# Altium project N64_Controller.PrjPcb
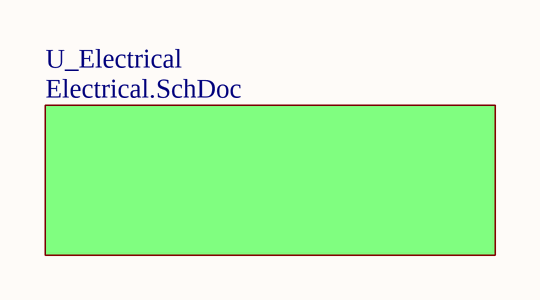
[diagram p0: TopSheet.SchDoc]
9 sheets, 114 parts. Net scope: strictly hierarchical (ports join the sheet entries above them; power ports are local).
Board file: PCB1.PcbDoc
Sheets:
  TopSheet.SchDoc
    U_Electrical = Electrical.SchDoc
      U_MCU = MCU.SchDoc
      U_USB = USB.SchDoc
      U_N64Connector = N64Connector.SchDoc
      U_LEDs = LEDs.SchDoc
      U_Rumble = Rumble.SchDoc
      U_Power = Power.SchDoc
      U_Buttons = Buttons.SchDoc

## Sheet TopSheet.SchDoc
size A

### Sub-sheets
U_Electrical = Electrical.SchDoc: no entries

## Sheet Electrical.SchDoc
size A4
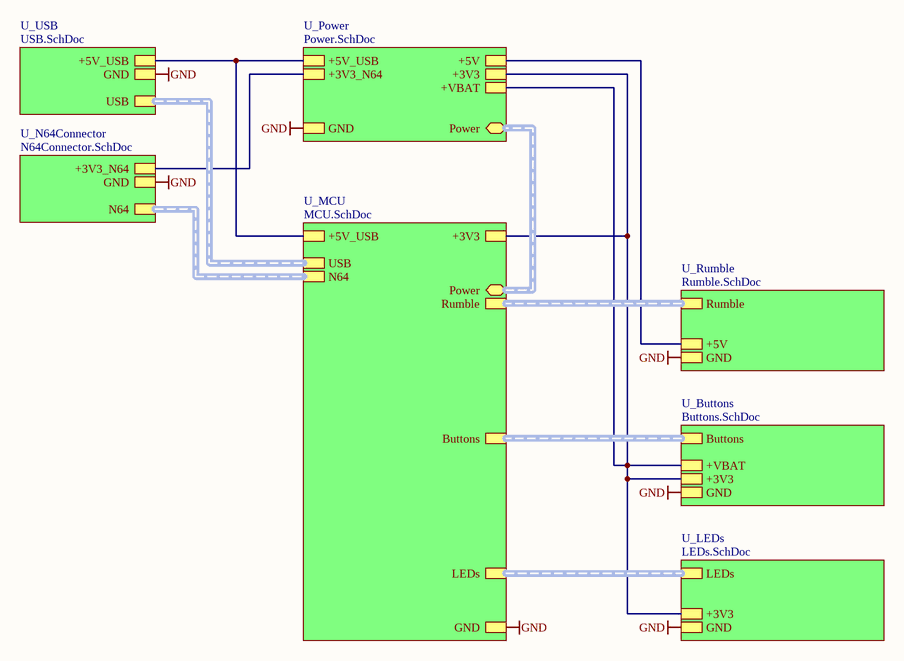
[diagram p1: Electrical.SchDoc]

### Sub-sheets
U_Buttons = Buttons.SchDoc: Buttons (harness Buttons), GND, +3V3, +VBAT
U_LEDs = LEDs.SchDoc: LEDs (harness LEDs), +3V3, GND
U_MCU = MCU.SchDoc: Buttons (harness Buttons), LEDs (harness LEDs), Rumble (harness Rumble), USB (harness USB), +3V3, +5V_USB, GND, N64 (harness N64), Power (harness Power)
U_N64Connector = N64Connector.SchDoc: N64 (harness N64), +3V3_N64, GND
U_Power = Power.SchDoc: +5V_USB, +3V3_N64, GND, +5V, +3V3, +VBAT, Power (harness Power)
U_Rumble = Rumble.SchDoc: GND, +5V, Rumble (harness Rumble)
U_USB = USB.SchDoc: +5V_USB, USB (harness USB), GND

### Nets
+3V3: sheet U_MCU/+3V3, sheet U_LEDs/+3V3, sheet U_Power/+3V3, sheet U_Power/+VBAT, sheet U_Buttons/+3V3, sheet U_Buttons/+VBAT
+3V3_N64: sheet U_N64Connector/+3V3_N64, sheet U_Power/+3V3_N64
+5V: sheet U_Rumble/+5V, sheet U_Power/+5V
+5V_USB: sheet U_MCU/+5V_USB, sheet U_USB/+5V_USB, sheet U_Power/+5V_USB
GND: sheet U_MCU/GND, sheet U_USB/GND, sheet U_N64Connector/GND, sheet U_LEDs/GND, sheet U_Rumble/GND, sheet U_Power/GND, sheet U_Buttons/GND

### Buses and harness runs
harness sheet U_Buttons/Buttons = sheet U_MCU/Buttons
harness sheet U_LEDs/LEDs = sheet U_MCU/LEDs
harness sheet U_MCU/N64 = sheet U_N64Connector/N64
harness sheet U_MCU/Power = sheet U_Power/Power
harness sheet U_MCU/Rumble = sheet U_Rumble/Rumble
harness sheet U_MCU/USB = sheet U_USB/USB

### Notes on the sheet
- Title
- Size:
- Date:
- A4
- Number:
- Time:
- Revision:
- Sheet
- of
- File:

## Sheet MCU.SchDoc: N64 Controller
size A4; Author: TheComet; Revision: 1.0.0; ProjectName: N64 Controller
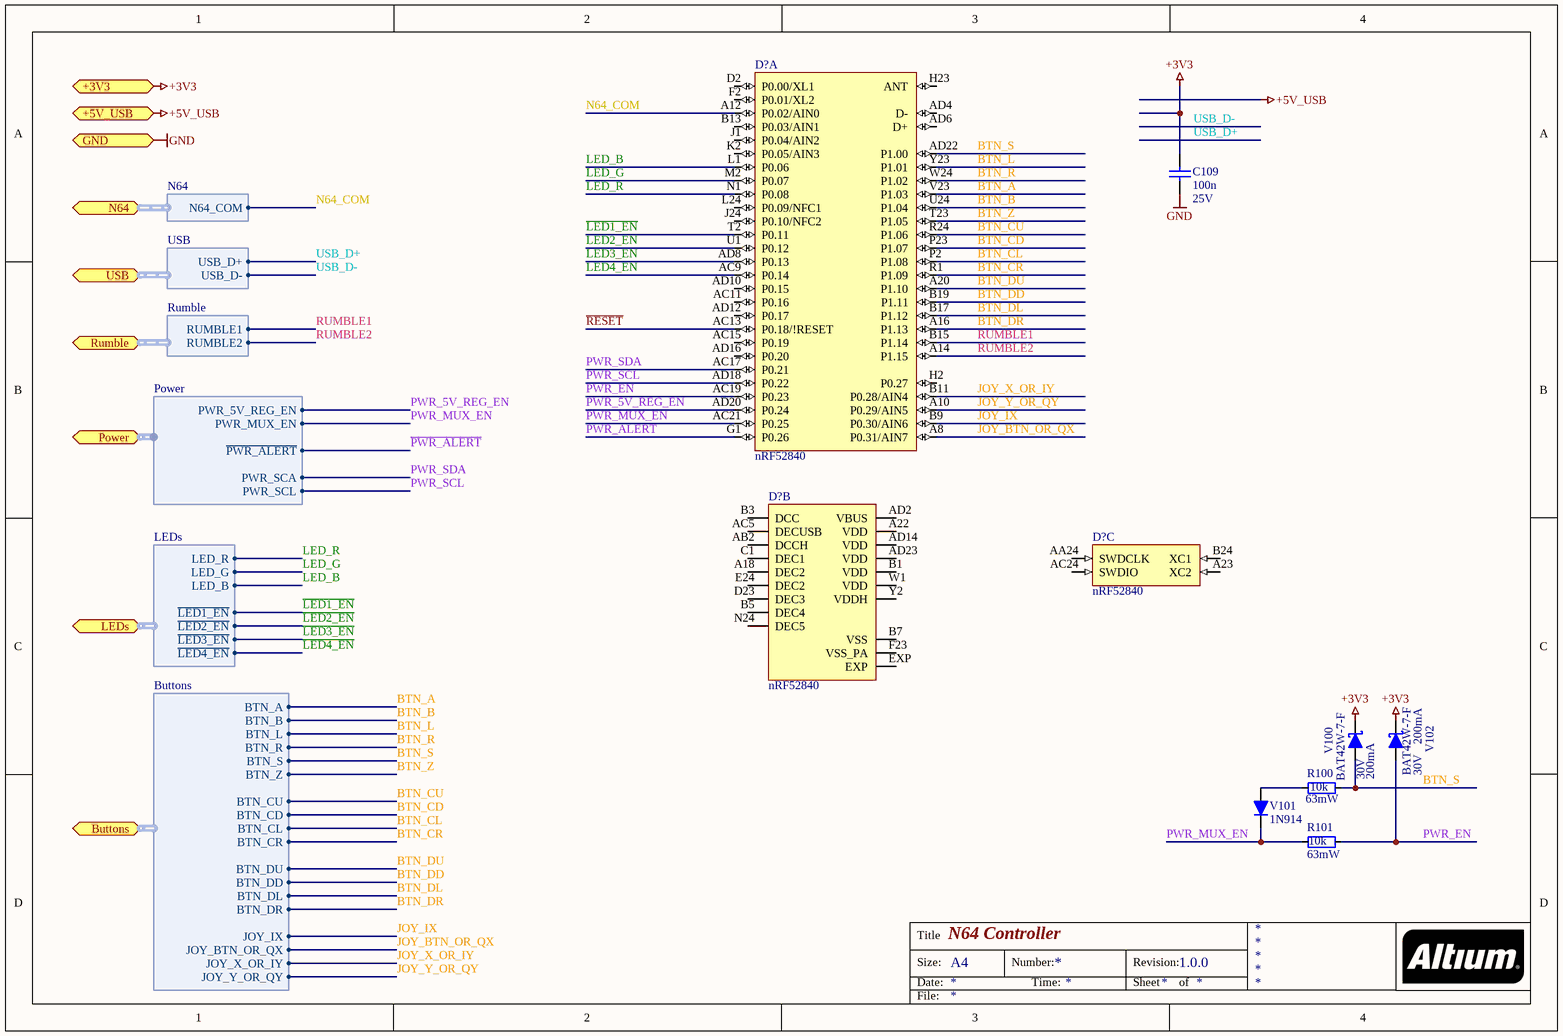
[diagram p2: MCU.SchDoc]

### Parts
(Parts that share a designator on the sheet are numbered #1, #2 ... from top to bottom, then left to right.)
C109  value 100n  Value2: 25V  [SMD_CAP_0402]  (hidden comment: C_SMD_CER_100N_25V_10%_X7R_0402)
D1  Type: nRF52840  [SMD_aQFN_73_nRF52840]  (hidden comment: D_NRF52840_aQFN-73)  (part C of 3)
D?#1  Type: nRF52840  [SMD_aQFN_73_nRF52840]  (hidden comment: D_NRF52840_aQFN-73)  (part A of 3)
D?#2  Type: nRF52840  [SMD_aQFN_73_nRF52840]  (hidden comment: D_NRF52840_aQFN-73)  (part B of 3)
R100  value 10k  Value2: 63mW  [SMD_RES_0402]  (hidden comment: R_SMD_THINFILM_10K_0W063_0%5_25PPM_0402)
R101  value 10k  Value2: 63mW  [SMD_RES_0402]  (hidden comment: R_SMD_THINFILM_10K_0W063_0%5_25PPM_0402)
V100  value 30V  Type: BAT42W-7-F  Value2: 200mA  [SMD_SOD_123]  (hidden comment: V_SMD_SCHOTTKY_BAT42W-7-F_30V_0A2_SOD-123)
V101  Type: 1N914  [SMD_SOD_323]  (hidden comment: V_SMD_DIODE_1N914_75V_0A15_SOD-323)
V102  value 30V  Type: BAT42W-7-F  Value2: 200mA  [SMD_SOD_123]  (hidden comment: V_SMD_SCHOTTKY_BAT42W-7-F_30V_0A2_SOD-123)

### Ports
+3V3, +5V_USB, Buttons (harness Buttons), GND, LEDs (harness LEDs), N64 (harness N64), Power (harness Power), Rumble (harness Rumble), USB (harness USB)

### Harnesses
LEDs: LED_R, LED_G, LED_B, ~{LED1_EN}, ~{LED2_EN}, ~{LED3_EN}, ~{LED4_EN}
Rumble: RUMBLE1, RUMBLE2
USB: USB_D-, USB_D+
N64: N64_COM
Buttons: BTN_A, BTN_B, BTN_CD, BTN_CL, BTN_CR, BTN_CU, BTN_DD, BTN_DL, BTN_DR, BTN_DU, BTN_L, BTN_R, BTN_S, BTN_Z, JOY_BTN_OR_QX, JOY_IX, JOY_X_OR_IY, JOY_Y_OR_QY
Power: ~{PWR_ALERT}, PWR_5V_REG_EN, PWR_MUX_EN, PWR_SCA, PWR_SCL

### Nets
+3V3: C109.2 V100.2 V102.2 ; port +3V3
GND: C109.1 ; port GND
BTN_A: D?#1.V23(P1.03) ; port Buttons.BTN_A
BTN_B: D?#1.U24(P1.04) ; port Buttons.BTN_B
BTN_CD: D?#1.P23(P1.07) ; port Buttons.BTN_CD
BTN_CL: D?#1.P2(P1.08) ; port Buttons.BTN_CL
BTN_CR: D?#1.R1(P1.09) ; port Buttons.BTN_CR
BTN_CU: D?#1.R24(P1.06) ; port Buttons.BTN_CU
BTN_DD: D?#1.B19(P1.11) ; port Buttons.BTN_DD
BTN_DL: D?#1.B17(P1.12) ; port Buttons.BTN_DL
BTN_DR: D?#1.A16(P1.13) ; port Buttons.BTN_DR
BTN_DU: D?#1.A20(P1.10) ; port Buttons.BTN_DU
BTN_L: D?#1.Y23(P1.01) ; port Buttons.BTN_L
BTN_R: D?#1.W24(P1.02) ; port Buttons.BTN_R
BTN_S: D?#1.AD22(P1.00) R100.2 V100.1 ; port Buttons.BTN_S
BTN_Z: D?#1.T23(P1.05) ; port Buttons.BTN_Z
JOY_BTN_OR_QX: D?#1.A8(P0.31/AIN7) ; port Buttons.JOY_BTN_OR_QX
JOY_IX: D?#1.B9(P0.30/AIN6) ; port Buttons.JOY_IX
JOY_X_OR_IY: D?#1.B11(P0.28/AIN4) ; port Buttons.JOY_X_OR_IY
JOY_Y_OR_QY: D?#1.A10(P0.29/AIN5) ; port Buttons.JOY_Y_OR_QY
~{LED1_EN}: D?#1.T2(P0.11) ; port LEDs.~{LED1_EN}
~{LED2_EN}: D?#1.U1(P0.12) ; port LEDs.~{LED2_EN}
~{LED3_EN}: D?#1.AD8(P0.13) ; port LEDs.~{LED3_EN}
~{LED4_EN}: D?#1.AC9(P0.14) ; port LEDs.~{LED4_EN}
LED_B: D?#1.L1(P0.06) ; port LEDs.LED_B
LED_G: D?#1.M2(P0.07) ; port LEDs.LED_G
LED_R: D?#1.N1(P0.08) ; port LEDs.LED_R
N64_COM: D?#1.A12(P0.02/AIN0) ; port N64.N64_COM
~{PWR_ALERT}: D?#1.G1(P0.26) ; port Power.~{PWR_ALERT}
PWR_5V_REG_EN: D?#1.AD20(P0.24) ; port Power.PWR_5V_REG_EN
PWR_EN: D?#1.AC19(P0.23) R101.2 V102.1
PWR_MUX_EN: D?#1.AC21(P0.25) R101.1 V101.2 ; port Power.PWR_MUX_EN
PWR_SCL: D?#1.AD18(P0.22) ; port Power.PWR_SCL
PWR_SDA: D?#1.AC17(P0.21) ; port Power.PWR_SCA
~{RESET}: D?#1.AC13(P0.18/!RESET)
RUMBLE1: D?#1.B15(P1.14) ; port Rumble.RUMBLE1
RUMBLE2: D?#1.A14(P1.15) ; port Rumble.RUMBLE2
NetR100_1: R100.1 V101.1

Not connected (* = marked no-connect by the designer): D1 A23(XC2) AA24(SWDCLK) AC24(SWDIO) B24(XC1); D?#1 AC11(P0.16) AC15(P0.19) AD4(D-) AD6(D+) AD10(P0.15) AD12(P0.17) AD16(P0.20) B13(P0.03/AIN1) D2(P0.00/XL1) F2(P0.01/XL2) H2(P0.27) H23(ANT) J1(P0.04/AIN2) J24(P0.10/NFC2) K2(P0.05/AIN3) L24(P0.09/NFC1); D?#2 A18(DEC2) A22(VDD) AB2(DCCH) AC5(DECUSB) AD2(VBUS) AD14(VDD) AD23(VDD) B1(VDD) B3(DCC) B5(DEC4) B7(VSS) C1(DEC1) D23(DEC3) E24(DEC2) EXP F23(VSS_PA) N24(DEC5) W1(VDD) Y2(VDDH)

### Notes on the sheet
- Title
- Size:
- Date:
- A4
- Number:
- Time:
- Revision:
- Sheet
- of
- File:

### Library data of the parts
C109 = C_SMD_CER_100N_25V_10%_X7R_0402: 0.1µF ±10% 25V Ceramic Capacitor X7R 0402 (1005 Metric); Supplier - Digikey: 490-14603-1-ND
D1 D?#1 D?#2 = D_NRF52840_aQFN-73: IC RF TxRx + MCU 802.15.4, Bluetooth Bluetooth v5.0 2.4GHz 73-VFQFN Dual Rows, Exposed Pad; Supplier - Digikey: 1490-1071-1-ND
R100 R101 = R_SMD_THINFILM_10K_0W063_0%5_25PPM_0402: SMD Resistor; Supplier - Digikey: P10KDECT-ND
V100 V102 = V_SMD_SCHOTTKY_BAT42W-7-F_30V_0A2_SOD-123: Diode Schottky 30V 200mA (DC) Surface Mount SOD-123; Supplier - Digikey: BAT42W-FDICT-ND
V101 = V_SMD_DIODE_1N914_75V_0A15_SOD-323: SMD Diode, 75V, 0.15A; Supplier - Digikey: 1N914BWSCT-ND

## Sheet USB.SchDoc
size A4
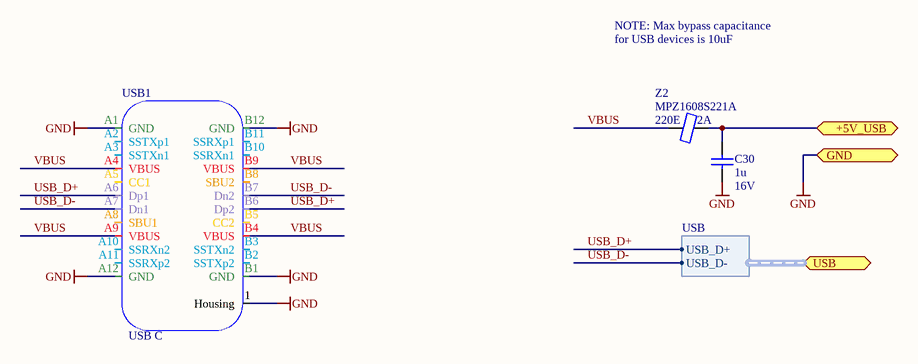
[diagram p3: USB.SchDoc]

### Parts
C30  value 1u  Value2: 16V  [SMD_CAP_0603]  (hidden comment: C_SMD_CER_1U_16V_10%_X7R_0603)
USB1  Type: USB C  [SMD_CON_USB_TYPEC_VERTICAL_10132328-10011LF]  (hidden comment: *)
Z2  value 220E  Type: MPZ1608S221A  Value2: 2A  [SMD_RES_0603]  (hidden comment: Z_SMD_FERRITE_2A_220E@100MHZ_0603)

### Ports
+5V_USB, GND, USB (harness USB)

### Harnesses
USB: USB_D-, USB_D+

### Nets
+5V_USB: C30.2 Z2.2 ; port +5V_USB
GND: C30.1 USB1.1(Housing) USB1.A1(GND) USB1.A12(GND) USB1.B1(GND) USB1.B12(GND) ; port GND
USB_D+: USB1.A6(Dp1) USB1.B6(Dp2) ; port USB.USB_D+
USB_D-: USB1.A7(Dn1) USB1.B7(Dn2) ; port USB.USB_D-
VBUS: USB1.A4(VBUS) USB1.A9(VBUS) USB1.B4(VBUS) USB1.B9(VBUS) Z2.1

Not connected (* = marked no-connect by the designer): USB1 A2(SSTXp1) A3(SSTXn1) A5(CC1) A8(SBU1) A10(SSRXn2) A11(SSRXp2) B2(SSTXp2) B3(SSTXn2) B5(CC2) B8(SBU2) B10(SSRXn1) B11(SSRXp1)

### Notes on the sheet
- NOTE: Max bypass capacitance
- for USB devices is 10uF
- Title
- Size:
- Date:
- A4
- Number:
- Time:
- Revision:
- Sheet
- of
- File:

### Library data of the parts
C30 = C_SMD_CER_1U_16V_10%_X7R_0603: 1µF ±10% 16V Ceramic Capacitor X7R 0603 (1608 Metric); Supplier - Digikey: 1276-1019-1-ND
USB1 = X_CONNECTOR_USB_TYPEC_VERTICAL: USB - C (Type - C) USB 3.1 (USB 3.1 Gen 2, Superspeed+) Receptacle Connector 24 Position Surface Mount, Through Hole; Supplier - Digikey: 609-5380-1-ND
Z2 = Z_SMD_FERRITE_2A_220E@100MHZ_0603: Ferrite Beads; Supplier - E+H Flowtec AG: 50104604; Supplier - Digikey: 445-1565-1-ND

## Sheet N64Connector.SchDoc
size A4
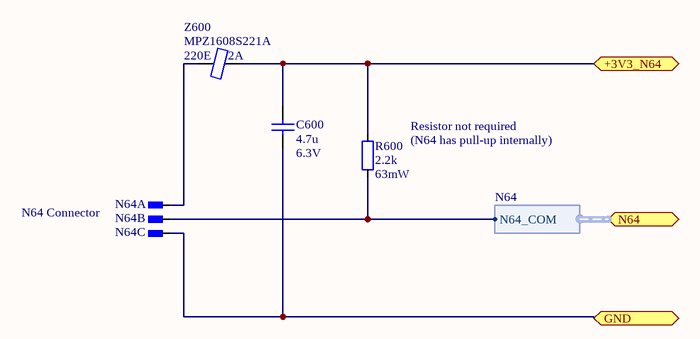
[diagram p4: N64Connector.SchDoc]

### Parts
C600  value 4.7u  Value2: 6.3V  [SMD_CAP_0603]  (hidden comment: C_SMD_CER_4U7_6V3_10%_X5R_0603)
N64  X_CONNECTOR_P2.54_D0.9_1X3  [THT_CON_P2.54_D0.9_1X3]  (value not drawn)  (parts A,B,C of 3)
R600  value 2.2k  Value2: 63mW  [SMD_RES_0402]  (hidden comment: R_SMD_THINFILM_2K2_0W063_0%5_25PPM_0402)
Z600  value 220E  Type: MPZ1608S221A  Value2: 2A  [SMD_RES_0603]  (hidden comment: Z_SMD_FERRITE_2A_220E@100MHZ_0603)

### Ports
+3V3_N64, GND, N64 (harness N64)

### Harnesses
N64: N64_COM

### Nets
+3V3_N64: C600.2 R600.2 Z600.2 ; port +3V3_N64
GND: C600.1 N64.3 ; port GND
N64_COM: N64.2 R600.1 ; port N64.N64_COM
NetN64_1: N64.1 Z600.1

### Notes on the sheet
- (near R600) Resistor not required
- (near R600) (N64 has pull-up internally)
- N64 Connector
- Title
- Size:
- Date:
- A4
- Number:
- Time:
- Revision:
- Sheet
- of
- File:

### Library data of the parts
N64 = X_CONNECTOR_P2.54_D0.9_1X3: Pitch 2.54, Diameter 0.9mm, 1 row, 3 columns; Type: Pitch 2.54, Diameter 0.9mm, 1 row, 3 columns
R600 = R_SMD_THINFILM_2K2_0W063_0%5_25PPM_0402: 2.2 kOhms ±0.5% 0.063W, 1/16W Chip Resistor 0402 (1005 Metric) Automotive AEC-Q200 Thin Film; Supplier - Digikey: P2.2KDECT-ND
Z600 = Z_SMD_FERRITE_2A_220E@100MHZ_0603: Ferrite Beads; Supplier - E+H Flowtec AG: 50104604; Supplier - Digikey: 445-1565-1-ND
C600 = C_SMD_CER_4U7_6V3_10%_X5R_0603: Supplier - Digikey: 1276-1045-1-ND

## Sheet LEDs.SchDoc
size A4
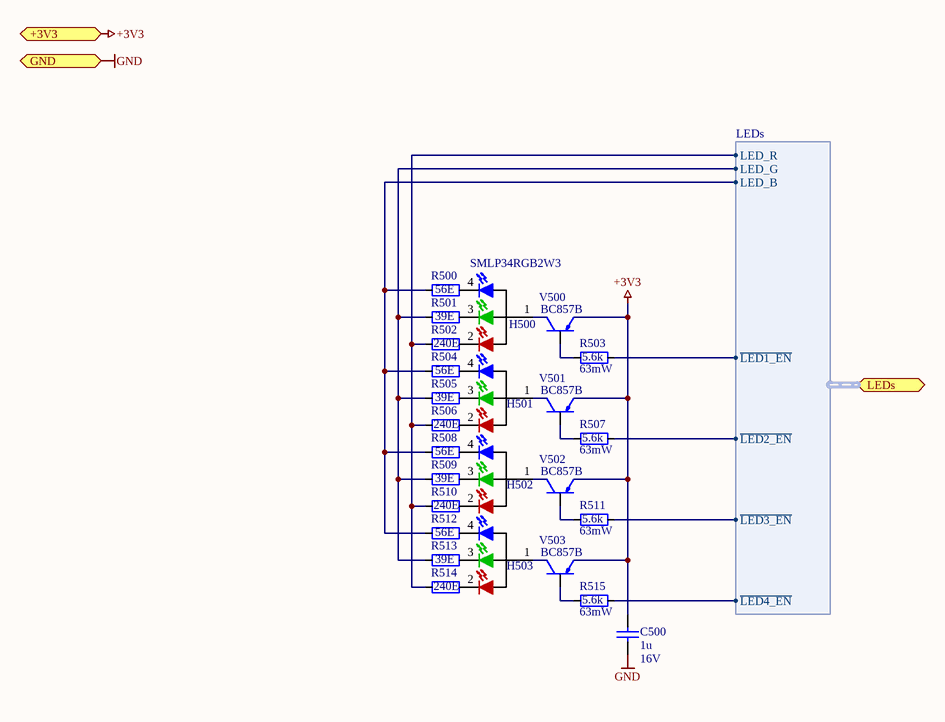
[diagram p5: LEDs.SchDoc]

### Parts
C500  value 1u  Value2: 16V  [SMD_CAP_0603]  (hidden comment: C_SMD_CER_1U_16V_10%_X7R_0603)
H500  Type: SMLP34RGB2W3  [SMD_LED_0404]  (hidden comment: H_SMD_LED_RGB_DIFFUSED_5MA_0404)
H501  H_SMD_LED_RGB_DIFFUSED_5MA_0404  [SMD_LED_0404]  (value not drawn)
H502  H_SMD_LED_RGB_DIFFUSED_5MA_0404  [SMD_LED_0404]  (value not drawn)
H503  H_SMD_LED_RGB_DIFFUSED_5MA_0404  [SMD_LED_0404]  (value not drawn)
R500  value 56E  [SMD_RES_0402]  (hidden comment: R_SMD_THINFILM_56E_0W063_0%5_50PPM_0402)
R501  value 39E  [SMD_RES_0402]  (hidden comment: R_SMD_THINFILM_39E_0W063_0%5_50PPM_0402)
R502  value 240E  [SMD_RES_0402]  (hidden comment: R_SMD_THINFILM_240E_0W063_0%5_25PPM_0402)
R503  value 5.6k  Value2: 63mW  [SMD_RES_0402]  (hidden comment: R_SMD_THINFILM_5K6_0W063_0%5_25PPM_0402)
R504  value 56E  [SMD_RES_0402]  (hidden comment: R_SMD_THINFILM_56E_0W063_0%5_50PPM_0402)
R505  value 39E  [SMD_RES_0402]  (hidden comment: R_SMD_THINFILM_39E_0W063_0%5_50PPM_0402)
R506  value 240E  [SMD_RES_0402]  (hidden comment: R_SMD_THINFILM_240E_0W063_0%5_25PPM_0402)
R507  value 5.6k  Value2: 63mW  [SMD_RES_0402]  (hidden comment: R_SMD_THINFILM_5K6_0W063_0%5_25PPM_0402)
R508  value 56E  [SMD_RES_0402]  (hidden comment: R_SMD_THINFILM_56E_0W063_0%5_50PPM_0402)
R509  value 39E  [SMD_RES_0402]  (hidden comment: R_SMD_THINFILM_39E_0W063_0%5_50PPM_0402)
R510  value 240E  [SMD_RES_0402]  (hidden comment: R_SMD_THINFILM_240E_0W063_0%5_25PPM_0402)
R511  value 5.6k  Value2: 63mW  [SMD_RES_0402]  (hidden comment: R_SMD_THINFILM_5K6_0W063_0%5_25PPM_0402)
R512  value 56E  [SMD_RES_0402]  (hidden comment: R_SMD_THINFILM_56E_0W063_0%5_50PPM_0402)
R513  value 39E  [SMD_RES_0402]  (hidden comment: R_SMD_THINFILM_39E_0W063_0%5_50PPM_0402)
R514  value 240E  [SMD_RES_0402]  (hidden comment: R_SMD_THINFILM_240E_0W063_0%5_25PPM_0402)
R515  value 5.6k  Value2: 63mW  [SMD_RES_0402]  (hidden comment: R_SMD_THINFILM_5K6_0W063_0%5_25PPM_0402)
V500  Type: BC857B  [SMD_SOT_23_3]  (hidden comment: V_SMD_TRANS_PNP_BC857B_45V_0A1_SOT-23-3)
V501  Type: BC857B  [SMD_SOT_23_3]  (hidden comment: V_SMD_TRANS_PNP_BC857B_45V_0A1_SOT-23-3)
V502  Type: BC857B  [SMD_SOT_23_3]  (hidden comment: V_SMD_TRANS_PNP_BC857B_45V_0A1_SOT-23-3)
V503  Type: BC857B  [SMD_SOT_23_3]  (hidden comment: V_SMD_TRANS_PNP_BC857B_45V_0A1_SOT-23-3)

### Ports
+3V3, GND, LEDs (harness LEDs)

### Harnesses
LEDs: ~{LED1_EN}, ~{LED2_EN}, ~{LED3_EN}, ~{LED4_EN}, LED_B, LED_G, LED_R

### Nets
+3V3: C500.2 V500.2(E) V501.2(E) V502.2(E) V503.2(E) ; port +3V3
GND: C500.1 ; port GND
~{LED1_EN}: R503.2 ; port LEDs.~{LED1_EN}
~{LED2_EN}: R507.2 ; port LEDs.~{LED2_EN}
~{LED3_EN}: R511.2 ; port LEDs.~{LED3_EN}
~{LED4_EN}: R515.2 ; port LEDs.~{LED4_EN}
LED_B: R500.1 R504.1 R508.1 R512.1 ; port LEDs.LED_B
LED_G: R501.1 R505.1 R509.1 R513.1 ; port LEDs.LED_G
LED_R: R502.1 R506.1 R510.1 R514.1 ; port LEDs.LED_R
NetH500_1: H500.1 V500.3(C)
NetH500_2: H500.2 R502.2
NetH500_3: H500.3 R501.2
NetH500_4: H500.4 R500.2
NetH501_1: H501.1 V501.3(C)
NetH501_2: H501.2 R506.2
NetH501_3: H501.3 R505.2
NetH501_4: H501.4 R504.2
NetH502_1: H502.1 V502.3(C)
NetH502_2: H502.2 R510.2
NetH502_3: H502.3 R509.2
NetH502_4: H502.4 R508.2
NetH503_1: H503.1 V503.3(C)
NetH503_2: H503.2 R514.2
NetH503_3: H503.3 R513.2
NetH503_4: H503.4 R512.2
NetR503_1: R503.1 V500.1(B)
NetR507_1: R507.1 V501.1(B)
NetR511_1: R511.1 V502.1(B)
NetR515_1: R515.1 V503.1(B)

### Notes on the sheet
- Title
- Size:
- Date:
- A4
- Number:
- Time:
- Revision:
- Sheet
- of
- File:

### Library data of the parts
C500 = C_SMD_CER_1U_16V_10%_X7R_0603: as C30 on sheet USB; Supplier - Digikey: 1276-1019-1-ND
H500-H503 = H_SMD_LED_RGB_DIFFUSED_5MA_0404: Red, Green, Blue (RGB) 624nm Red, 527nm Green, 470nm Blue LED Indication - Discrete 2.1V Red, 3.1V Green, 3V Blue 0404 (1010 Metric); Supplier - Digikey: SMLP34RGB2W3CT-ND
R500 R504 R508 R512 = R_SMD_THINFILM_56E_0W063_0%5_50PPM_0402: 56 Ohms ±0.5% 0.063W, 1/16W Chip Resistor 0402 (1005 Metric) Thin Film; Supplier - Digikey: 311-56UCT-ND
R501 R505 R509 R513 = R_SMD_THINFILM_39E_0W063_0%5_50PPM_0402: 39 Ohms ±0.5% 0.063W, 1/16W Chip Resistor 0402 (1005 Metric) Thin Film; Supplier - Digikey: 311-39UCT-ND
R502 R506 R510 R514 = R_SMD_THINFILM_240E_0W063_0%5_25PPM_0402: 240 Ohms ±0.5% 0.063W, 1/16W Chip Resistor 0402 (1005 Metric) Automotive AEC-Q200 Thin Film; Supplier - Digikey: P240DECT-ND
R503 R507 R511 R515 = R_SMD_THINFILM_5K6_0W063_0%5_25PPM_0402: 5.6 kOhms ±0.5% 0.063W, 1/16W Chip Resistor 0402 (1005 Metric) Automotive AEC-Q200 Thin Film; Supplier - Digikey: RNCF0402DTE5K60CT-ND
V500-V503 = V_SMD_TRANS_PNP_BC857B_45V_0A1_SOT-23-3: SMD PNP Transistor BC857B 100mA 45V; Supplier - Digikey: BC857BLT3GOSCT-ND

## Sheet Rumble.SchDoc
size A4
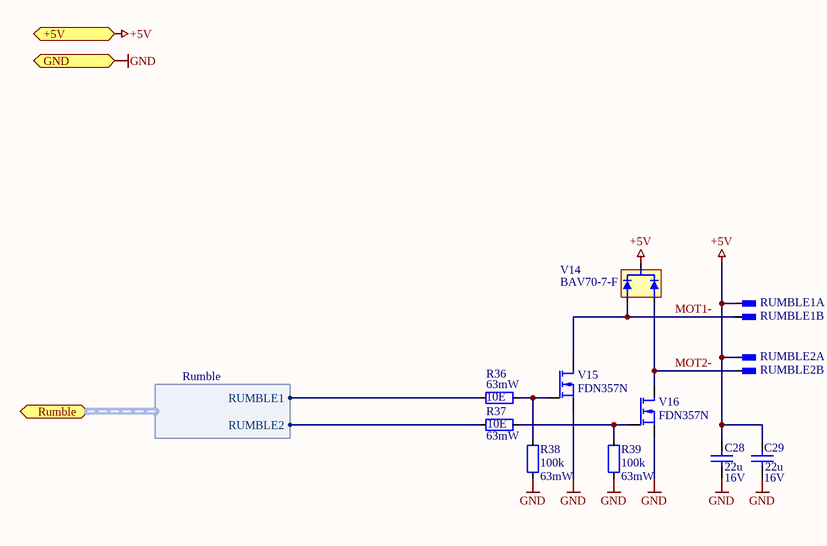
[diagram p6: Rumble.SchDoc]

### Parts
C28  value 22u  Value2: 16V  [SMD_CAP_0805]  (hidden comment: C_SMD_CER_22U_16V_10%_X5R_0805)
C29  value 22u  Value2: 16V  [SMD_CAP_0805]  (hidden comment: C_SMD_CER_22U_16V_10%_X5R_0805)
R36  value 10E  Value2: 63mW  [SMD_RES_0402]  (hidden comment: R_SMD_THINFILM_10E_0W063_0%5_50PPM_0402)
R37  value 10E  Value2: 63mW  [SMD_RES_0402]  (hidden comment: R_SMD_THINFILM_10E_0W063_0%5_50PPM_0402)
R38  value 100k  Value2: 63mW  [SMD_RES_0402]  (hidden comment: R_SMD_THINFILM_100K_0W063_1%_50PPM_0402)
R39  value 100k  Value2: 63mW  [SMD_RES_0402]  (hidden comment: R_SMD_THINFILM_100K_0W063_1%_50PPM_0402)
RUMBLE1  X_CONNECTOR_P2.54_D0.9_1X2  [THT_CON_P2.54_D0.9_1X2]  (value not drawn)  (parts A,B of 2)
RUMBLE2  X_CONNECTOR_P2.54_D0.9_1X2  [THT_CON_P2.54_D0.9_1X2]  (value not drawn)  (parts A,B of 2)
V14  Type: BAV70-7-F  [SMD_SOT_23_3]  (hidden comment: V_SMD_DIODE_ARRAY_75V_0A15_SOT23-3)
V15  Type: FDN357N  [SMD_SOT_23_3]  (hidden comment: V_SMD_FET_NMOS_FDN357N_30V_1A9_4NC2_0W5_SOT-23-3)
V16  Type: FDN357N  [SMD_SOT_23_3]  (hidden comment: V_SMD_FET_NMOS_FDN357N_30V_1A9_4NC2_0W5_SOT-23-3)

### Ports
+5V, GND, Rumble (harness Rumble)

### Harnesses
Rumble: RUMBLE1, RUMBLE2

### Nets
+5V: C28.2 C29.2 RUMBLE1.1 RUMBLE2.1 V14.3(Cathode) ; port +5V
GND: C28.1 C29.1 R38.1 R39.1 V15.2(Source) V16.2(Source) ; port GND
MOT1-: RUMBLE1.2 V14.1(Anode) V15.3(Drain)
MOT2-: RUMBLE2.2 V14.2(Anode) V16.3(Drain)
RUMBLE1: R36.1 ; port Rumble.RUMBLE1
RUMBLE2: R37.1 ; port Rumble.RUMBLE2
NetR36_2: R36.2 R38.2 V15.1(Gate)
NetR37_2: R37.2 R39.2 V16.1(Gate)

### Notes on the sheet
- Title
- Size:
- Date:
- A4
- Number:
- Time:
- Revision:
- Sheet
- of
- File:

### Library data of the parts
C28 C29 = C_SMD_CER_22U_16V_10%_X5R_0805: 22µF ±10% 16V Ceramic Capacitor X5R 0805 (2012 Metric); Supplier - Digikey: 1276-7092-1-ND
R36 R37 = R_SMD_THINFILM_10E_0W063_0%5_50PPM_0402: 10 Ohms ±0.5% 0.063W, 1/16W Chip Resistor 0402 (1005 Metric) Thin Film; Supplier - Digikey: 311-10UCT-ND
R38 R39 = R_SMD_THINFILM_100K_0W063_1%_50PPM_0402: 100 kOhms ±1% 0.063W, 1/16W Chip Resistor 0402 (1005 Metric) Thin Film; Supplier - Digikey: YAG2307CT-ND
RUMBLE1 RUMBLE2 = X_CONNECTOR_P2.54_D0.9_1X2: Pitch 2.54, Diameter 0.9mm, 1 row, 2 columns; Type: Pitch 2.54, Diameter 0.9mm, 1 row, 2 columns
V15 V16 = V_SMD_FET_NMOS_FDN357N_30V_1A9_4NC2_0W5_SOT-23-3: N-Channel Logic Level Enhancement Mode Field Effect Transistor; Supplier - E+H-flowtec SAP: 50110216; Supplier - Digikey: FDN357NCT-ND
V14 = V_SMD_DIODE_ARRAY_75V_0A15_SOT23-3: Supplier - Digikey: BAV70-FDICT-ND

## Sheet Power.SchDoc: N64 Controller
size A4; DrawnBy: TheComet
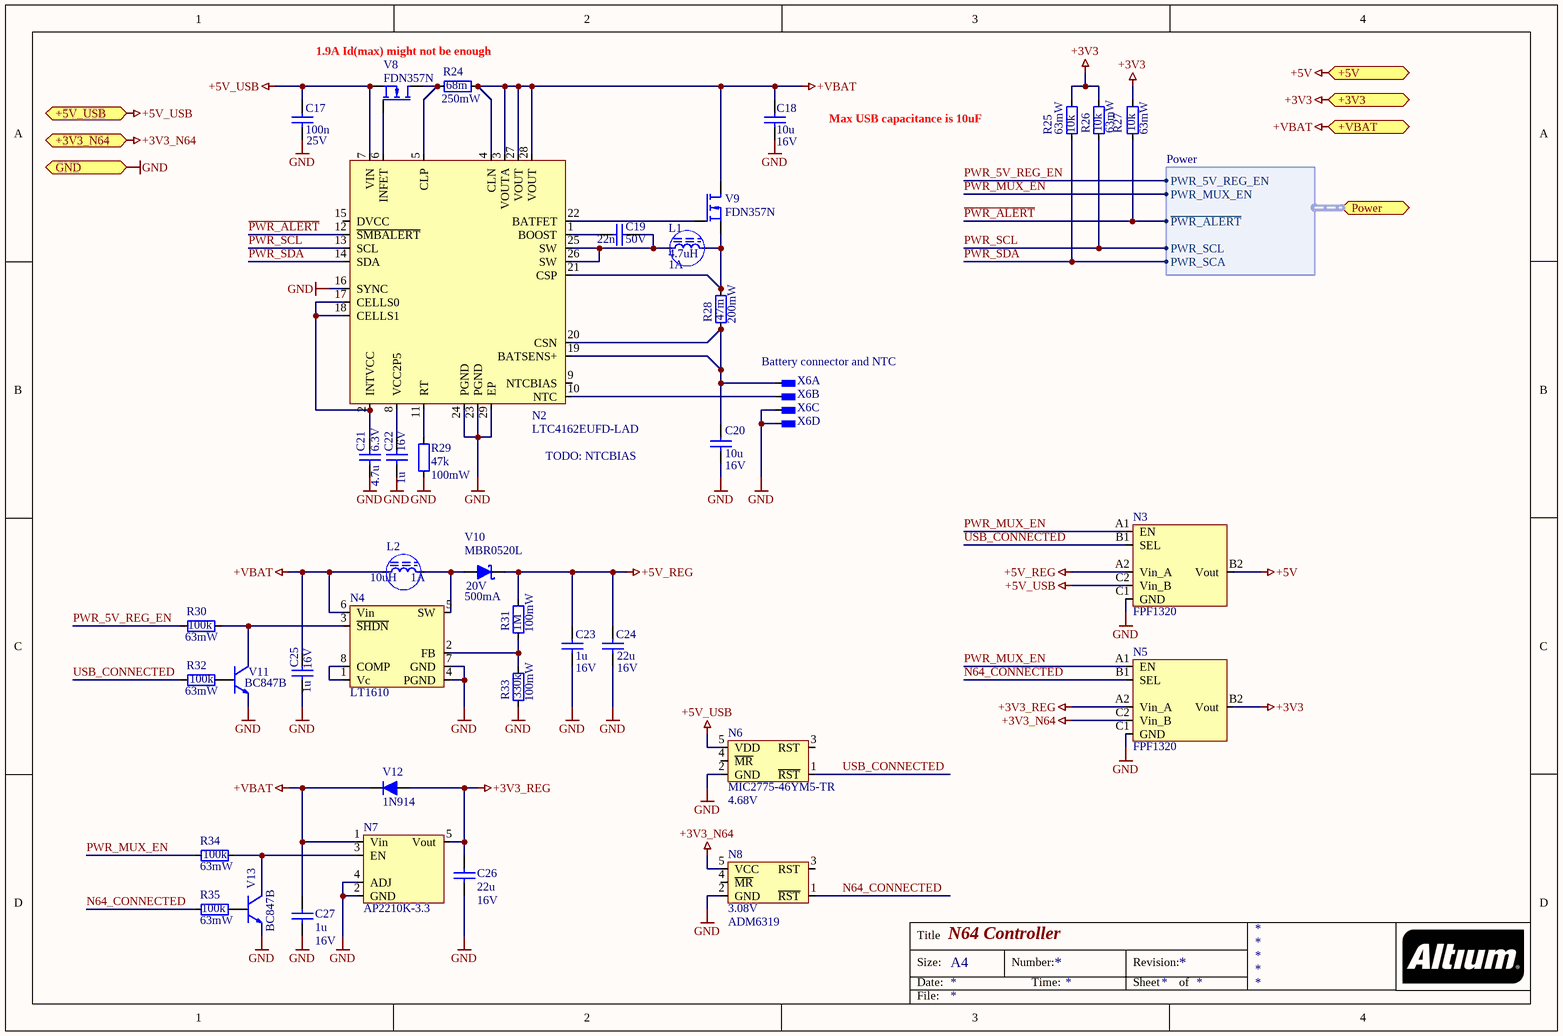
[diagram p7: Power.SchDoc]

### Parts
C17  value 100n  Value2: 25V  [SMD_CAP_0402]  (hidden comment: C_SMD_CER_100N_25V_10%_X7R_0402)
C18  value 10u  Value2: 16V  [SMD_CAP_0805]  (hidden comment: C_SMD_CER_10U_16V_10%_X7R_0805)
C19  value 22n  Value2: 50V  [SMD_CAP_0402]  (hidden comment: C_SMD_CER_22N_50V_10%_X7R_0402)
C20  value 10u  Value2: 16V  [SMD_CAP_0805]  (hidden comment: C_SMD_CER_10U_16V_10%_X7R_0805)
C21  value 4.7u  Value2: 6.3V  [SMD_CAP_0603]  (hidden comment: C_SMD_CER_4U7_6V3_10%_X5R_0603)
C22  value 1u  Value2: 16V  [SMD_CAP_0603]  (hidden comment: C_SMD_CER_1U_16V_10%_X7R_0603)
C23  value 1u  Value2: 16V  [SMD_CAP_0603]  (hidden comment: C_SMD_CER_1U_16V_10%_X7R_0603)
C24  value 22u  Value2: 16V  [SMD_CAP_0805]  (hidden comment: C_SMD_CER_22U_16V_10%_X5R_0805)
C25  value 1u  Value2: 16V  [SMD_CAP_0603]  (hidden comment: C_SMD_CER_1U_16V_10%_X7R_0603)
C26  value 22u  Value2: 16V  [SMD_CAP_0805]  (hidden comment: C_SMD_CER_22U_16V_10%_X5R_0805)
C27  value 1u  Value2: 16V  [SMD_CAP_0603]  (hidden comment: C_SMD_CER_1U_16V_10%_X7R_0603)
L1  value 4.7uH  Value2: 1A  [SMD_IND_0806]  (hidden comment: L_SMD_FERRITE_SHIELD_4U7_1A_20%_0806)
L2  value 10uH  Value2: 1A  [SMD_INDUCT-744025100]  (hidden comment: L_SMD_FERRITE_SHIELD_10U_1A_190MOHM_20%)
N2  Type: LTC4162EUFD-LAD  [QFN50P400X500X80_HS-29N]  (hidden comment: N_LTC4162EUFD-LAD_QFN-28)
N3  Type: FPF1320  [SMD_WLCSP_6_1.0X1.5]  (hidden comment: *)
N4  Type: LT1610  [SMD_MSOP-8]  (hidden comment: N_LT1610_MSOP-8)
N5  Type: FPF1320  [SMD_WLCSP_6_1.0X1.5]  (hidden comment: *)
N6  value 4.68V  Type: MIC2775-46YM5-TR  [SMD_SOT_23_5]  (hidden comment: N_MIC2775-46YM5-TR_SOT-23-5)
N7  AP2210K-3.3  [SMD_SOT_23_5]
N8  value 3.08V  Type: ADM6319  [SMD_SOT_23_5]  (hidden comment: N_ADM6319B31ARJZ-RL7_SOT-23-5)
R24  value 68m  Value2: 250mW  [SMD_RES_0603]  (hidden comment: R_SMD_THINFILM_0E068_0W25_1%_350PPM_0603)
R25  value 10k  Value2: 63mW  [SMD_RES_0402]  (hidden comment: R_SMD_THINFILM_10K_0W063_0%5_25PPM_0402)
R26  value 10k  Value2: 63mW  [SMD_RES_0402]  (hidden comment: R_SMD_THINFILM_10K_0W063_0%5_25PPM_0402)
R27  value 10k  Value2: 63mW  [SMD_RES_0402]  (hidden comment: R_SMD_THINFILM_10K_0W063_0%5_25PPM_0402)
R28  value 47m  Value2: 200mW  [SMD_RES_0603]  (hidden comment: R_SMD_THICKFILM_0E047_0W2_1%_200PPM_0603)
R29  value 47k  Value2: 100mW  [SMD_RES_0402]  (hidden comment: R_SMD_THINFILM_47K_0W1_0%5_25PPM_0402)
R30  value 100k  Value2: 63mW  [SMD_RES_0402]  (hidden comment: R_SMD_THINFILM_100K_0W063_1%_50PPM_0402)
R31  value 1M  Value2: 100mW  [SMD_RES_0402]  (hidden comment: R_SMD_THINFILM_1M_0W1_1%_50PPM_0402)
R32  value 100k  Value2: 63mW  [SMD_RES_0402]  (hidden comment: R_SMD_THINFILM_100K_0W063_1%_50PPM_0402)
R33  value 330k  Value2: 100mW  [SMD_RES_0402]  (hidden comment: R_SMD_THINFILM_330K_0W1_1%_50PPM_0402)
R34  value 100k  Value2: 63mW  [SMD_RES_0402]  (hidden comment: R_SMD_THINFILM_100K_0W063_1%_50PPM_0402)
R35  value 100k  Value2: 63mW  [SMD_RES_0402]  (hidden comment: R_SMD_THINFILM_100K_0W063_1%_50PPM_0402)
V8  Type: FDN357N  [SMD_SOT_23_3]  (hidden comment: V_SMD_FET_NMOS_FDN357N_30V_1A9_4NC2_0W5_SOT-23-3)
V9  Type: FDN357N  [SMD_SOT_23_3]  (hidden comment: V_SMD_FET_NMOS_FDN357N_30V_1A9_4NC2_0W5_SOT-23-3)
V10  value 20V  Type: MBR0520L  Value2: 500mA  [SMD_SOD_123]  (hidden comment: V_SMD_SCHOTTKY_MBR0520L_20V_0A5_SOD-123)
V11  Type: BC847B  [SMD_SOT_23_3]  (hidden comment: V_SMD_TRANS_NPN_BC847B_50V_0A2_SOT-23-3)
V12  Type: 1N914  [SMD_SOD_323]  (hidden comment: V_SMD_DIODE_1N914_75V_0A15_SOD-323)
V13  Type: BC847B  [SMD_SOT_23_3]  (hidden comment: V_SMD_TRANS_NPN_BC847B_50V_0A2_SOT-23-3)
X6  X_CONNECTOR_P2.54_D0.9_1X4  [THT_CON_P2.54_D0.9_1X4]  (value not drawn)  (parts A,B,C,D of 4)

### Ports
+3V3, +3V3_N64, +5V, +5V_USB, +VBAT, GND, Power (harness Power)

### Harnesses
Power: PWR_5V_REG_EN, ~{PWR_ALERT}, PWR_MUX_EN, PWR_SCL, PWR_SCA

### Nets
+3V3: C18.2 C25.2 C27.2 L2.1 N2.3(VOUTA) N2.4(CLN) N2.27(VOUT) N2.28(VOUT) N4.6(Vin) N5.B2(Vout) N7.1(Vin) R24.2 R25.2 R26.2 R27.2 V9.3(Drain) V12.2 ; port +3V3, port +VBAT  [also labelled +VBAT]
+3V3_N64: N5.C2(Vin_B) N8.5(VCC) ; port +3V3_N64
+3V3_REG: C26.2 N5.A2(Vin_A) N7.5(Vout) V12.1
+5V: N3.B2(Vout) ; port +5V
+5V_REG: C23.2 C24.2 N3.A2(Vin_A) R31.2 V10.2
+5V_USB: C17.2 N2.7(VIN) N3.C2(Vin_B) N6.5(VDD) V8.2(Source) ; port +5V_USB
GND: C17.1 C18.1 C20.1 C21.1 C22.1 C23.1 C24.1 C25.1 C26.1 C27.1 N2.16(SYNC) N2.23(PGND) N2.24(PGND) N2.29(EP) N3.C1(GND) N4.4(PGND) N4.7(GND) N5.C1(GND) N6.2(GND) N7.2(GND) N7.4(ADJ) N8.2(GND) R29.1 R33.1 V11.2(E) V13.2(E) X6.3 X6.4 ; port GND
N64_CONNECTED: N5.B1(SEL) N8.1(~{RST}) R35.1
~{PWR_ALERT}: N2.12(~{SMBALERT}) R27.1 ; port Power.~{PWR_ALERT}
PWR_5V_REG_EN: R30.1 ; port Power.PWR_5V_REG_EN
PWR_MUX_EN: N3.A1(EN) N5.A1(EN) R34.1 ; port Power.PWR_MUX_EN
PWR_SCL: N2.13(SCL) R26.1 ; port Power.PWR_SCL
PWR_SDA: N2.14(SDA) R25.1 ; port Power.PWR_SCA
USB_CONNECTED: N3.B1(SEL) N6.1(~{RST}) R32.1
NetC19_1: C19.1 N2.1(BOOST)
NetC19_2: C19.2 L1.1 N2.25(SW) N2.26(SW)
NetC20_2: C20.2 N2.19(BATSENS+) N2.20(CSN) R28.1 X6.1
NetC21_2: C21.2 N2.2(INTVCC) N2.17(CELLS0) N2.18(CELLS1)
NetC22_2: C22.2 N2.8(VCC2P5)
NetL1_2: L1.2 N2.21(CSP) R28.2 V9.2(Source)
NetL2_2: L2.2 N4.5(SW) V10.1
NetN2_5: N2.5(CLP) R24.1 V8.3(Drain)
NetN2_6: N2.6(INFET) V8.1(Gate)
NetN2_10: N2.10(NTC) X6.2
NetN2_11: N2.11(RT) R29.2
NetN2_22: N2.22(BATFET) V9.1(Gate)
NetN4_1: N4.1(Vc) N4.8(COMP)
NetN4_2: N4.2(FB) R31.1 R33.2
NetN4_3: N4.3(~{SHDN}) R30.2 V11.3(C)
NetN7_3: N7.3(EN) R34.2 V13.3(C)
NetR32_2: R32.2 V11.1(B)
NetR35_2: R35.2 V13.1(B)

Not connected (* = marked no-connect by the designer): N2 9(NTCBIAS) 15(DVCC); N6 3(RST) 4(~{MR}); N8 3(RST) 4(~{MR})

### Notes on the sheet
- 1.9A Id(max) might not be enough
- Max USB capacitance is 10uF
- (near X6) Battery connector and NTC
- (near N2) TODO: NTCBIAS
- Title
- Size:
- Date:
- A4
- Number:
- Time:
- Revision:
- Sheet
- of
- File:

### Library data of the parts
C17 = C_SMD_CER_100N_25V_10%_X7R_0402: as C109 on sheet MCU; Supplier - Digikey: 490-14603-1-ND
C18 C20 = C_SMD_CER_10U_16V_10%_X7R_0805: 10µF ±10% 16V Ceramic Capacitor X7R 0805 (2012 Metric); Supplier - Digikey: 1276-6472-1-ND
C19 = C_SMD_CER_22N_50V_10%_X7R_0402: 0.022µF ±10% 50V Ceramic Capacitor X7R 0402 (1005 Metric); Supplier - Digikey: 490-3884-1-ND
C22 C23 C25 C27 = C_SMD_CER_1U_16V_10%_X7R_0603: as C30 on sheet USB; Supplier - Digikey: 1276-1019-1-ND
C24 C26 = C_SMD_CER_22U_16V_10%_X5R_0805: as C28 on sheet Rumble; Supplier - Digikey: 1276-7092-1-ND
L1 = L_SMD_FERRITE_SHIELD_4U7_1A_20%_0806: SMD Inductor; Supplier - Digikey: 732-2956-1-ND
L2 = L_SMD_FERRITE_SHIELD_10U_1A_190MOHM_20%: FIXED IND 10UH 1A 190 MOHM SMD; Type: 744025100; Supplier - Digikey: 732-2617-1-ND
N2 = N_LTC4162EUFD-LAD_QFN-28: 35V/3.2A MULTI-CELL LITHIUM-ION; Supplier - Digikey: LTC4162EUFD-LAD#PBF-ND
N3 N5 = N_FPF1320UCX_WLCSP-6: Power Switch/Driver 2:1 P-Channel 1.5A 6-WLCSP (0.96x1.66); Supplier - Digikey: FPF1320UCXCT-ND
N6 = N_MIC2775-46YM5-TR_SOT-23-5: IC SUPERVISOR MICROPOWER SOT23-5; Supplier - Digikey: 576-2684-1-ND
N7 = N_AP2210K-3.3_SOT-23-5: IC REG LINEAR 3.3V 300MA SOT23-5; Supplier - Digikey: AP2210K-3.3TRG1DICT-ND; Type: AP2210K-3.3
N8 = N_ADM6319B31ARJZ-RL7_SOT-23-5: IC SUPERVISOR MANUAL RST SOT23-5; Supplier - Digikey: ADM6319B31ARJZ-RL7DKR-ND
R24 = R_SMD_THINFILM_0E068_0W25_1%_350PPM_0603: 68 mOhms ±1% 0.25W, 1/4W Chip Resistor 0603 (1608 Metric) Current Sense Thin Film; Supplier - Digikey: 408-1445-1-ND
R25-R27 = R_SMD_THINFILM_10K_0W063_0%5_25PPM_0402: SMD Resistor; Supplier - Digikey: P10KDECT-ND
R28 = R_SMD_THICKFILM_0E047_0W2_1%_200PPM_0603: 47 mOhms ±1% 0.2W, 1/5W Chip Resistor 0603 (1608 Metric) Automotive AEC-Q200, Current Sense Thick Film; Supplier - Digikey: P47LJCT-ND
R29 = R_SMD_THINFILM_47K_0W1_0%5_25PPM_0402: 47 kOhms ±0.5% 0.063W, 1/16W Chip Resistor 0402 (1005 Metric) Automotive AEC-Q200 Thin Film; Supplier - Digikey: P47KDECT-ND
R30 R32 R34 R35 = R_SMD_THINFILM_100K_0W063_1%_50PPM_0402: as R38 on sheet Rumble; Supplier - Digikey: YAG2307CT-ND
R31 = R_SMD_THINFILM_1M_0W1_1%_50PPM_0402: 1 MOhms ±1% 0.1W, 1/10W Chip Resistor 0402 (1005 Metric) Anti-Sulfur Thin Film; Supplier - Digikey: MCS0402-1.00M-CFCT-ND
R33 = R_SMD_THINFILM_330K_0W1_1%_50PPM_0402: 330 kOhms ±1% 0.1W, 1/10W Chip Resistor 0402 (1005 Metric) Anti-Sulfur Thin Film; Supplier - Digikey: 749-1575-1-ND
V8 V9 = V_SMD_FET_NMOS_FDN357N_30V_1A9_4NC2_0W5_SOT-23-3: as V15 on sheet Rumble; Supplier - E+H-flowtec SAP: 50110216; Supplier - Digikey: FDN357NCT-ND
V10 = V_SMD_SCHOTTKY_MBR0520L_20V_0A5_SOD-123: DIODE SCHOTTKY 20V 500MA SOD123; Supplier - Digikey: MBR0520LCT-ND
V11 V13 = V_SMD_TRANS_NPN_BC847B_50V_0A2_SOT-23-3: NPN Transistor; Supplier - E+H-flowtec SAP: 50019820; Supplier - Digikey: BC847BLT1GOSCT-ND
V12 = V_SMD_DIODE_1N914_75V_0A15_SOD-323: SMD Diode, 75V, 0.15A; Supplier - Digikey: 1N914BWSCT-ND
X6 = X_CONNECTOR_P2.54_D0.9_1X4: Pitch 2.54, Diameter 0.9mm, 1 row, 4 columns; Type: Pitch 2.54, Diameter 0.9mm, 1 row, 3 columns
C21 = C_SMD_CER_4U7_6V3_10%_X5R_0603: Supplier - Digikey: 1276-1045-1-ND
N4 = N_LT1610_MSOP-8: Supplier - Digikey: LT1610CMS8#PBF-ND

## Sheet Buttons.SchDoc
size A4
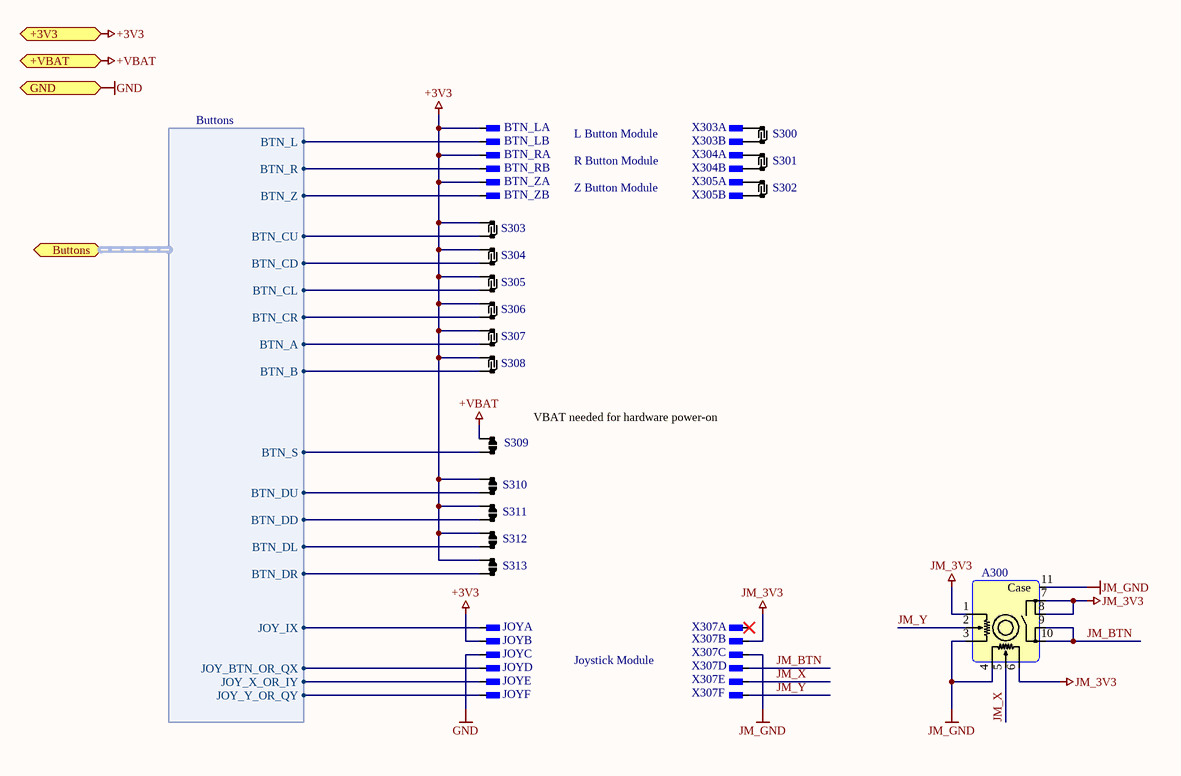
[diagram p8: Buttons.SchDoc]

### Parts
A300  A_JOYSTICK_MODULE_RKJXK122400Y  [A_JOYSTICK_MODULE_RKJXK122400Y]  (value not drawn)
BTN_L  X_CONNECTOR_P2.54_D0.9_1X2  [THT_CON_P2.54_D0.9_1X2]  (value not drawn)  (parts A,B of 2)
BTN_R  X_CONNECTOR_P2.54_D0.9_1X2  [THT_CON_P2.54_D0.9_1X2]  (value not drawn)  (parts A,B of 2)
BTN_Z  X_CONNECTOR_P2.54_D0.9_1X2  [THT_CON_P2.54_D0.9_1X2]  (value not drawn)  (parts A,B of 2)
JOY  X_CONNECTOR_P2.54_D0.9_2X3  [THT_CON_P2.54_D0.9_2X3]  (value not drawn)  (parts A,B,C,D,E,F of 6)
S300  S_N64_FINGER_CARBON_CONTACT  [SMD_N64_FINGER_CARBON_CONTACT]  (value not drawn)
S301  S_N64_FINGER_CARBON_CONTACT  [SMD_N64_FINGER_CARBON_CONTACT]  (value not drawn)
S302  S_N64_FINGER_CARBON_CONTACT  [SMD_N64_FINGER_CARBON_CONTACT]  (value not drawn)
S303  S_N64_FINGER_CARBON_CONTACT  [SMD_N64_FINGER_CARBON_CONTACT]  (value not drawn)
S304  S_N64_FINGER_CARBON_CONTACT  [SMD_N64_FINGER_CARBON_CONTACT]  (value not drawn)
S305  S_N64_FINGER_CARBON_CONTACT  [SMD_N64_FINGER_CARBON_CONTACT]  (value not drawn)
S306  S_N64_FINGER_CARBON_CONTACT  [SMD_N64_FINGER_CARBON_CONTACT]  (value not drawn)
S307  S_N64_FINGER_CARBON_CONTACT  [SMD_N64_FINGER_CARBON_CONTACT]  (value not drawn)
S308  S_N64_FINGER_CARBON_CONTACT  [SMD_N64_FINGER_CARBON_CONTACT]  (value not drawn)
S309  S_N64_START_CARBON_CONTACT  [SMD_N64_START_CARBON_CONTACT]  (value not drawn)
S310  S_N64_DPAD_CARBON_CONTACT  [SMD_N64_DPAD_CARBON_CONTACT]  (value not drawn)
S311  S_N64_DPAD_CARBON_CONTACT  [SMD_N64_DPAD_CARBON_CONTACT]  (value not drawn)
S312  S_N64_DPAD_CARBON_CONTACT  [SMD_N64_DPAD_CARBON_CONTACT]  (value not drawn)
S313  S_N64_DPAD_CARBON_CONTACT  [SMD_N64_DPAD_CARBON_CONTACT]  (value not drawn)
X303  X_CONNECTOR_P2.54_D0.9_1X2  [THT_CON_P2.54_D0.9_1X2]  (value not drawn)  (parts A,B of 2)
X304  X_CONNECTOR_P2.54_D0.9_1X2  [THT_CON_P2.54_D0.9_1X2]  (value not drawn)  (parts A,B of 2)
X305  X_CONNECTOR_P2.54_D0.9_1X2  [THT_CON_P2.54_D0.9_1X2]  (value not drawn)  (parts A,B of 2)
X307  X_CONNECTOR_P2.54_D0.9_2X3  [THT_CON_P2.54_D0.9_2X3]  (value not drawn)  (parts A,B,C,D,E,F of 6)

### Ports
+3V3, +VBAT, Buttons (harness Buttons), GND

### Harnesses
Buttons: BTN_A, BTN_B, BTN_CD, BTN_CL, BTN_CR, BTN_CU, BTN_DD, BTN_DL, BTN_DR, BTN_DU, JOY_Y_OR_QY, BTN_L, BTN_R, BTN_S, BTN_Z, JOY_IX, JOY_BTN_OR_QX, JOY_X_OR_IY

### Nets
+3V3: BTN_L.1 BTN_R.1 BTN_Z.1 JOY.2 S303.1 S304.1 S305.1 S306.1 S307.1 S308.1 S309.1 S310.1 S311.1 S312.1 S313.1 ; port +3V3, port +VBAT  [also labelled +VBAT]
GND: JOY.3 ; port GND
JM_3V3: A300.1(XV+) A300.6(YV-) A300.7(BTN+) A300.8(BTN+) X307.2
JM_GND: A300.3(XV-) A300.4(YV+) A300.11(Case) X307.3
BTN_A: S307.2 ; port Buttons.BTN_A
BTN_B: S308.2 ; port Buttons.BTN_B
BTN_CD: S304.2 ; port Buttons.BTN_CD
BTN_CL: S305.2 ; port Buttons.BTN_CL
BTN_CR: S306.2 ; port Buttons.BTN_CR
BTN_CU: S303.2 ; port Buttons.BTN_CU
BTN_DD: S311.2 ; port Buttons.BTN_DD
BTN_DL: S312.2 ; port Buttons.BTN_DL
BTN_DR: S313.2 ; port Buttons.BTN_DR
BTN_DU: S310.2 ; port Buttons.BTN_DU
BTN_L: BTN_L.2 ; port Buttons.BTN_L
BTN_R: BTN_R.2 ; port Buttons.BTN_R
BTN_S: S309.2 ; port Buttons.BTN_S
BTN_Z: BTN_Z.2 ; port Buttons.BTN_Z
JM_BTN: A300.9(BTN-) A300.10(BTN-) X307.4
JM_X: A300.5(Y) X307.5
JM_Y: A300.2(X) X307.6
JOY_BTN_OR_QX: JOY.4 ; port Buttons.JOY_BTN_OR_QX
JOY_IX: JOY.1 ; port Buttons.JOY_IX
JOY_X_OR_IY: JOY.5 ; port Buttons.JOY_X_OR_IY
JOY_Y_OR_QY: JOY.6 ; port Buttons.JOY_Y_OR_QY
NetS300_1: S300.1 X303.1
NetS300_2: S300.2 X303.2
NetS301_1: S301.1 X304.1
NetS301_2: S301.2 X304.2
NetS302_1: S302.1 X305.1
NetS302_2: S302.2 X305.2

Not connected (* = marked no-connect by the designer): X307 1*

### Notes on the sheet
- L Button Module
- R Button Module
- Z Button Module
- VBAT needed for hardware power-on
- Joystick Module
- Title
- Size:
- Date:
- A4
- Number:
- Time:
- Revision:
- Sheet
- of
- File:

### Library data of the parts
BTN_L BTN_R BTN_Z X303-X305 = X_CONNECTOR_P2.54_D0.9_1X2: as RUMBLE1 on sheet Rumble; Type: Pitch 2.54, Diameter 0.9mm, 1 row, 2 columns
JOY X307 = X_CONNECTOR_P2.54_D0.9_2X3: Pitch 2.54, Diameter 0.9mm, 2 row, 3 columns; Type: Pitch 2.54, Diameter 0.9mm, 2 row, 3 columns
S300-S308 = S_N64_FINGER_CARBON_CONTACT: N64 DPAD Carbon ink contact
S309 = S_N64_START_CARBON_CONTACT: N64 DPAD Carbon ink contact
S310-S313 = S_N64_DPAD_CARBON_CONTACT: N64 DPAD Carbon ink contact
A300 = A_JOYSTICK_MODULE_RKJXK122400Y: Type: RKJXK122400Y

## Nets that join several sheets
+3V3: MCU (C109.2 V100.2 V102.2), LEDs (5 pins), Power (17 pins), Buttons (15 pins)
+3V3_N64: N64Connector (C600.2 R600.2 Z600.2), Power (N5.C2 N8.5)
+5V: Rumble (5 pins), Power (N3.B2)
+5V_USB: USB (C30.2 Z2.2), Power (5 pins)
GND: MCU (C109.1), USB (6 pins), N64Connector (C600.1 N64.3), LEDs (C500.1), Rumble (6 pins), Power (28 pins), Buttons (JOY.3)
BTN_A: MCU (D?#1.V23), Buttons (S307.2)
BTN_B: MCU (D?#1.U24), Buttons (S308.2)
BTN_CD: MCU (D?#1.P23), Buttons (S304.2)
BTN_CL: MCU (D?#1.P2), Buttons (S305.2)
BTN_CR: MCU (D?#1.R1), Buttons (S306.2)
BTN_CU: MCU (D?#1.R24), Buttons (S303.2)
BTN_DD: MCU (D?#1.B19), Buttons (S311.2)
BTN_DL: MCU (D?#1.B17), Buttons (S312.2)
BTN_DR: MCU (D?#1.A16), Buttons (S313.2)
BTN_DU: MCU (D?#1.A20), Buttons (S310.2)
BTN_L: MCU (D?#1.Y23), Buttons (BTN_L.2)
BTN_R: MCU (D?#1.W24), Buttons (BTN_R.2)
BTN_S: MCU (D?#1.AD22 R100.2 V100.1), Buttons (S309.2)
BTN_Z: MCU (D?#1.T23), Buttons (BTN_Z.2)
JOY_BTN_OR_QX: MCU (D?#1.A8), Buttons (JOY.4)
JOY_IX: MCU (D?#1.B9), Buttons (JOY.1)
JOY_X_OR_IY: MCU (D?#1.B11), Buttons (JOY.5)
JOY_Y_OR_QY: MCU (D?#1.A10), Buttons (JOY.6)
~{LED1_EN}: MCU (D?#1.T2), LEDs (R503.2)
~{LED2_EN}: MCU (D?#1.U1), LEDs (R507.2)
~{LED3_EN}: MCU (D?#1.AD8), LEDs (R511.2)
~{LED4_EN}: MCU (D?#1.AC9), LEDs (R515.2)
LED_B: MCU (D?#1.L1), LEDs (R500.1 R504.1 R508.1 R512.1)
LED_G: MCU (D?#1.M2), LEDs (R501.1 R505.1 R509.1 R513.1)
LED_R: MCU (D?#1.N1), LEDs (R502.1 R506.1 R510.1 R514.1)
N64_COM: MCU (D?#1.A12), N64Connector (N64.2 R600.1)
~{PWR_ALERT}: MCU (D?#1.G1), Power (N2.12 R27.1)
PWR_5V_REG_EN: MCU (D?#1.AD20), Power (R30.1)
PWR_MUX_EN: MCU (D?#1.AC21 R101.1 V101.2), Power (N3.A1 N5.A1 R34.1)
PWR_SCL: MCU (D?#1.AD18), Power (N2.13 R26.1)
PWR_SDA: MCU (D?#1.AC17), Power (N2.14 R25.1)
RUMBLE1: MCU (D?#1.B15), Rumble (R36.1)
RUMBLE2: MCU (D?#1.A14), Rumble (R37.1)